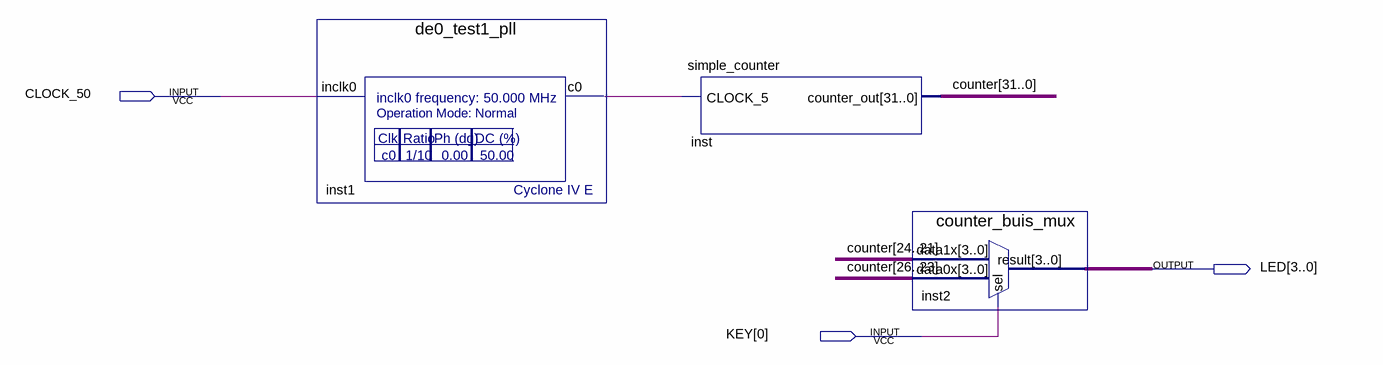
[diagram p0: schematic sheet]
// Quartus schematic de0_test1.bdf as structural Verilog: 3 symbols, 3 pins
module de0_test1 (
  input  CLOCK_50,
  input  [0:0] KEY,
  output [3:0] LED
);

  wire inst1_c0;
  wire [31:0] counter;

  de0_test1_pll inst1 (.inclk0(CLOCK_50), .c0(inst1_c0));
  simple_counter inst (.CLOCK_5(inst1_c0), .counter_out(counter));
  counter_buis_mux inst2 (.data1x(counter[24:21]), .data0x(counter[26:23]), .sel(KEY[0]), .result(LED));
endmodule
